# EasyEDA schematic 1-Schematic_Indoor meteo sensor.json
TITLE: Indoor environment monitor; REV: 1.0; Date: 2020-02-07; Sheet: 1/1; Drawn By: Tomáš Filo; Company: DIY
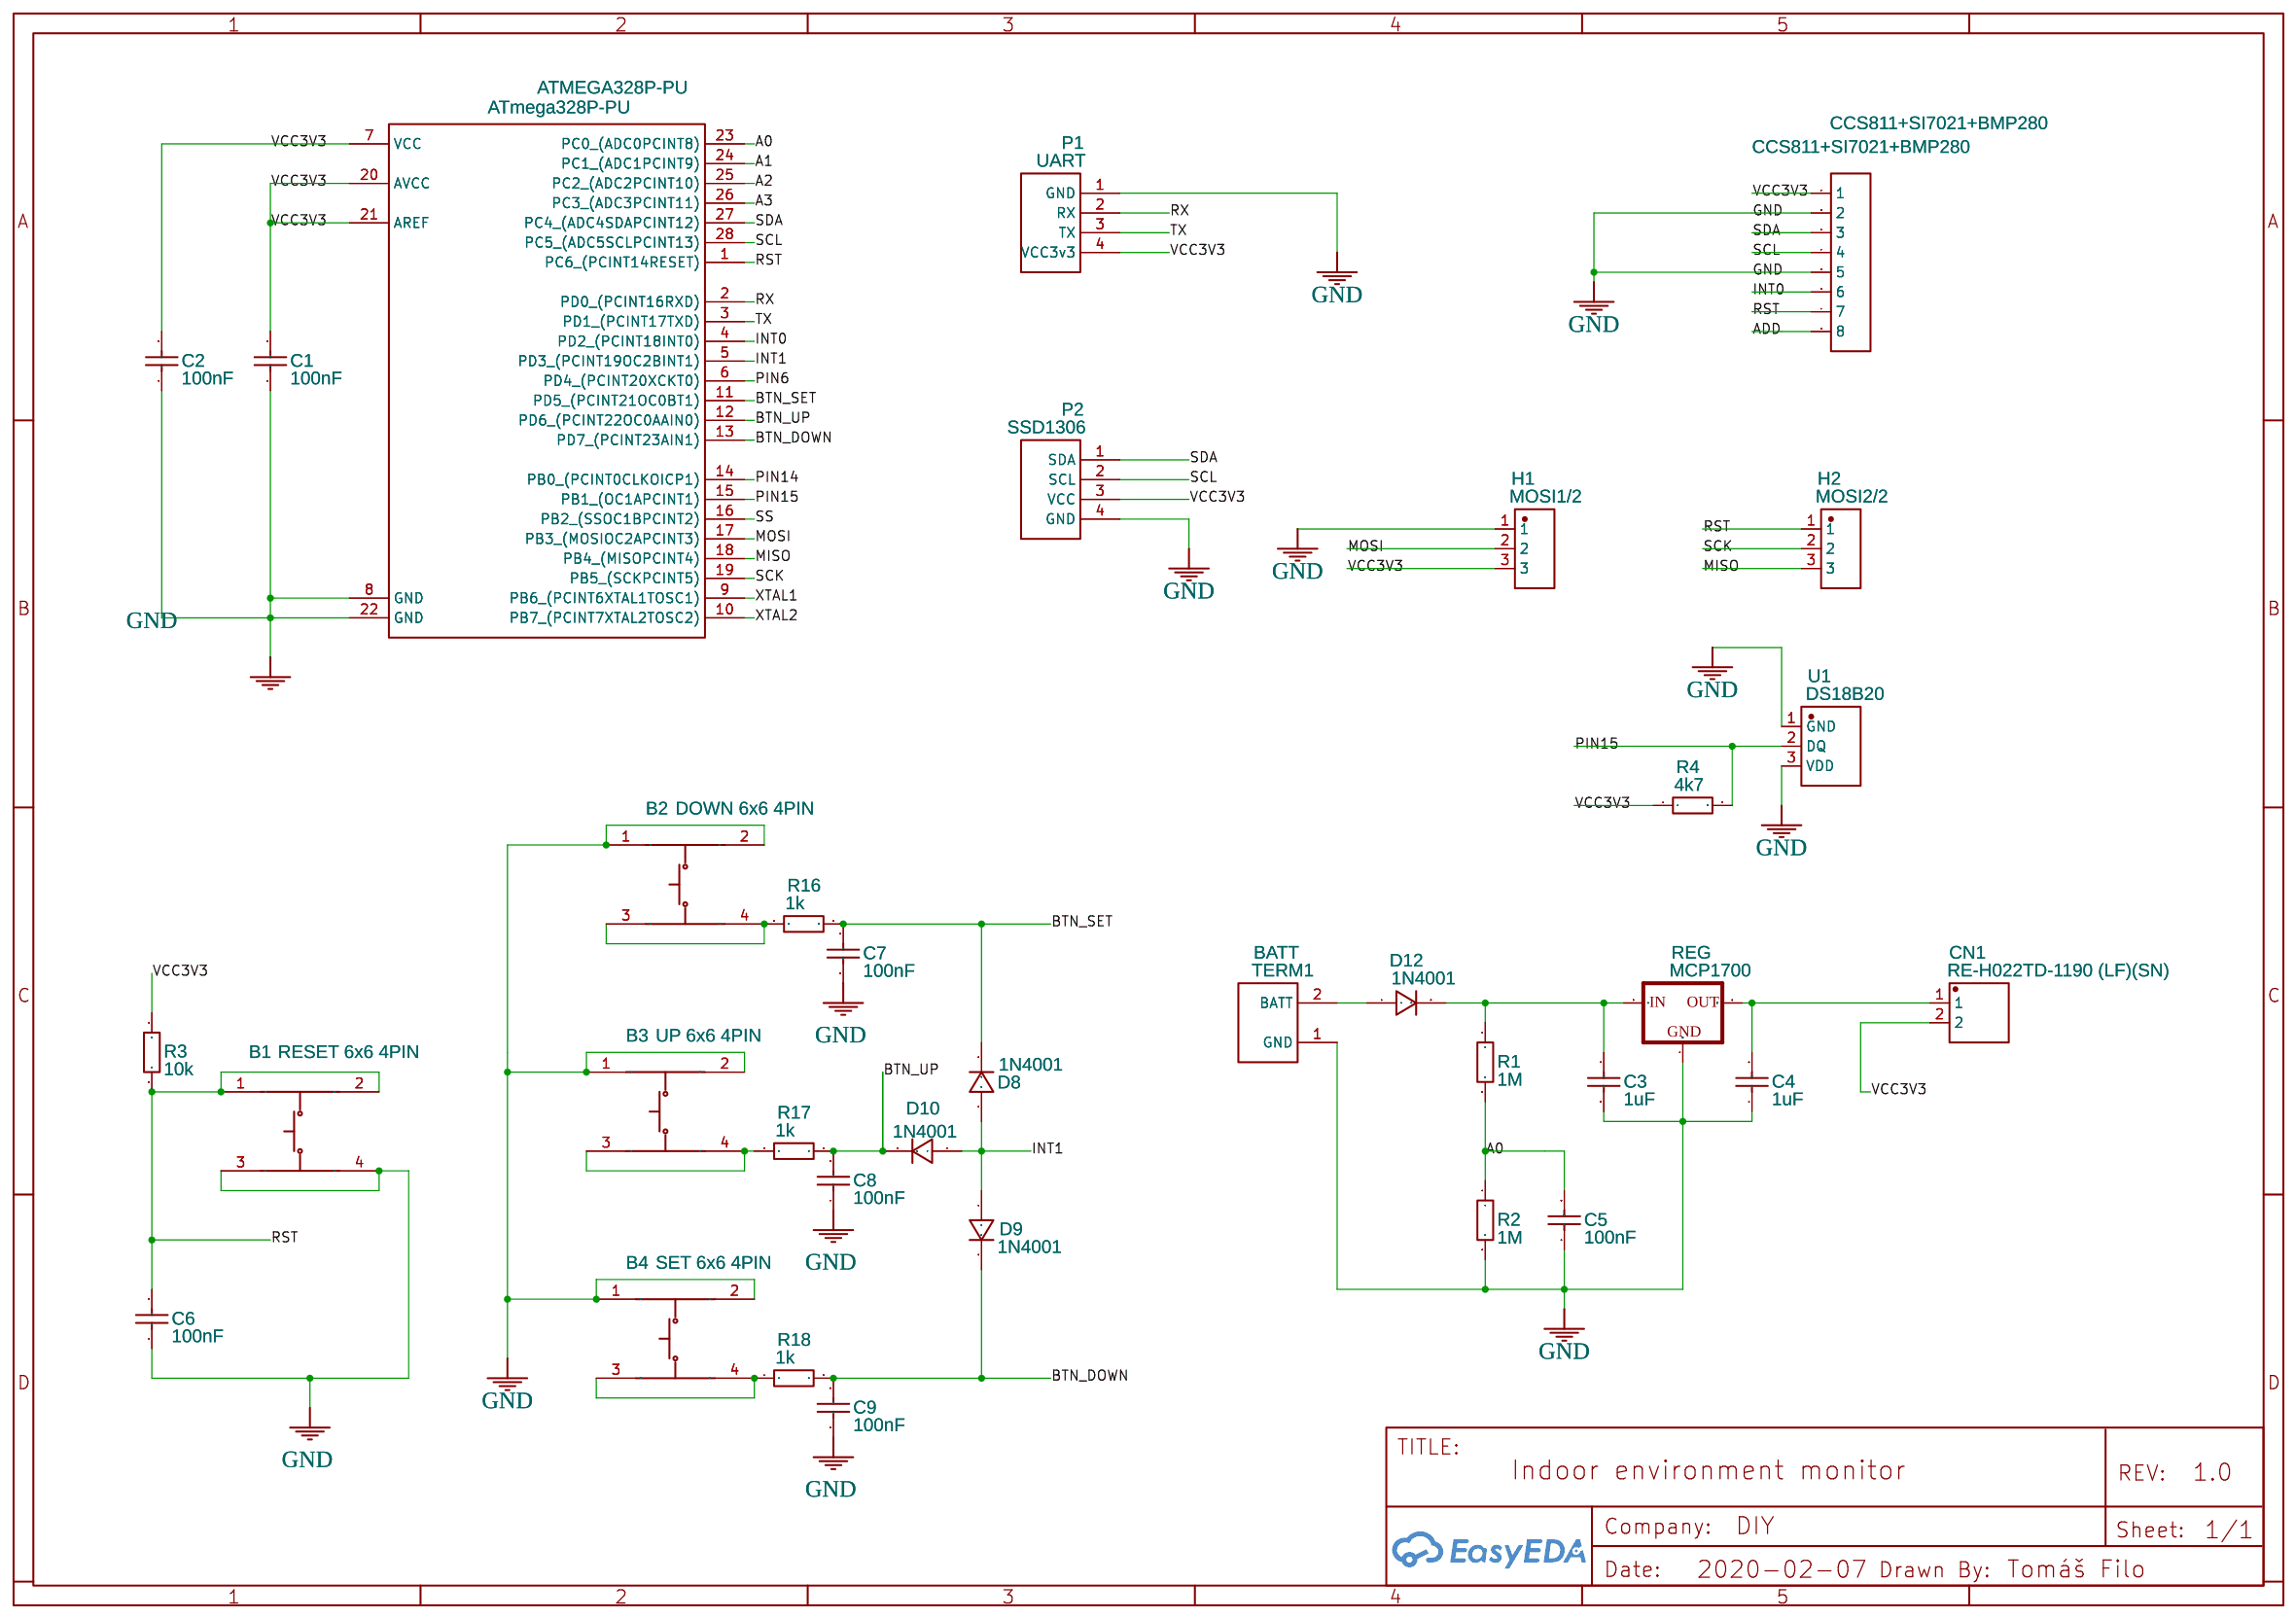
[diagram p0: schematic sheet]

## Parts
ATMEGA328P-PU  ATmega328P-PU  [DIP28]
B1  RESET 6x6 4PIN  [SW-TH_4PIN-L6.00-W6.00]
B2  DOWN 6x6 4PIN  [SW-TH_4PIN-L6.00-W6.00]
B3  UP 6x6 4PIN  [SW-TH_4PIN-L6.00-W6.00]
B4  SET 6x6 4PIN  [SW-TH_4PIN-L6.00-W6.00]
BATT  TERM1  [MKDSN1.5/2-5.08]
C1  100nF  [CAP-0.2]
C2  100nF  [CAP-0.2]
C3  1uF  [CAP-0.2]
C4  1uF  [CAP-0.2]
C5  100nF  [CAP-0.2]
C6  100nF  [CAP-0.2]
C7  100nF  [CAP-0.2]
C8  100nF  [CAP-0.2]
C9  100nF  [CAP-0.2]
CCS811+SI7021+BMP280  CCS811+SI7021+BMP280  [HDR-8X1/2.54]
CN1  RE-H022TD-1190 (LF)(SN)  [HDR-TH_2P-P2.54-V]
D8  1N4001  [DO-41]
D9  1N4001  [DO-41]
D10  1N4001  [DO-41]
D12  1N4001  [DO-41]
H1  MOSI1/2  [HDR-TH_3P-P2.54-V]
H2  MOSI2/2  [HDR-TH_3P-P2.54-V]
P1  UART  [DIP-1X4P2.54]
P2  SSD1306  [DIP-1X4P2.54]
R1  1M  [AXIAL-6.5X2.3(1/4W)]
R2  1M  [AXIAL-6.5X2.3(1/4W)]
R3  10k  [AXIAL-6.5X2.3(1/4W)]
R4  4k7  [AXIAL-6.5X2.3(1/4W)]
R16  1k  [AXIAL-6.5X2.3(1/4W)]
R17  1k  [AXIAL-6.5X2.3(1/4W)]
R18  1k  [AXIAL-6.5X2.3(1/4W)]
REG  MCP1700  [TO92-INLINE]
U1  DS18B20  [TO-92-3_L4.9-W3.7-P1.27-L]

## Library data of the parts
ATMEGA328P-PU = ATmega328P-PU: 8-bit AVR Microcontroller, 32KB Flash, 1KB EEPROM, 2KB SRAM, 28-pin PDIP, Industrial Grade (-40u7648 to 85u7648)
B1-B4 = -: Supplier: LCSC; Supplier Part: C381011; Manufacturer: XKB Enterprise; Manufacturer Part: TC-1102-C-E-B; Contributor: LCSC
BATT = -: Supplier: LCSC; Manufacturer: Phoenix Contact; Supplier Part: C91153
C1-C9 = CD1H224KC9BER1E000: Supplier: LCSC; Supplier Part: C263191; Manufacturer: Dersonic; Contributor: LCSC
CCS811+SI7021+BMP280 = -: Supplier: LCSC; Manufacturer: BOOMELE; Manufacturer Part: Female headerHDR1X8-2.54; Supplier Part: C27438
CN1 = RE-H022TD-1190 (LF)(SN): Supplier: LCSC; Supplier Part: C160332; Manufacturer: JST Sales America; Contributor: LCSC
D8-D10 D12 = -: Supplier Part: C169150; Supplier: LCSC; Manufacturer: DIOFIT; Contributor: LCSC
H1 H2 = 22025403P00CKMT: Supplier: LCSC; Manufacturer: Ckmtw; Contributor: LCSC; Supplier Part: C146690
P1 P2 = -: Supplier: LCSC; Manufacturer: Ckmtw; Manufacturer Part: 220S-1*4P H=8.5MM Ytype Gold-plated; Contributor: LCSC; Supplier Part: C124413
R1 R2 = MF1/4W-680Ω±1% T52: Supplier: LCSC; Supplier Part: C119320; Manufacturer: Chian Chia Elec; Contributor: LCSC
R3 R4 R16-R18 = MF1/4W-330Ω±1% T52: Supplier: LCSC; Supplier Part: C119313; Manufacturer: Chian Chia Elec; Contributor: LCSC
REG = -: Contributor: Adafruit
U1 = DS18B20: Supplier: LCSC; Supplier Part: C376006; Manufacturer: Youtai Semiconductor Co., Ltd.; Contributor: LCSC

## Nets
GND: ATMEGA328P-PU.8(GND) ATMEGA328P-PU.22(GND) B1.3 B1.4 B2.1 B2.2 B3.1 B3.2 B4.1 B4.2 BATT.1(GND) C1.1 C2.1 C3.1 C4.1 C5.1 C6.1 C7.1 C8.1 C9.1 CCS811+SI7021+BMP280.2 CCS811+SI7021+BMP280.5 H1.1 P1.1(GND) P2.4(GND) R2.2 REG.1(GND) U1.1(GND) U1.3(VDD)
VCC3V3: ATMEGA328P-PU.7(VCC) ATMEGA328P-PU.20(AVCC) ATMEGA328P-PU.21(AREF) C1.2 C2.2 CCS811+SI7021+BMP280.1 CN1.2 H1.3 P1.4(VCC3v3) P2.3(VCC) R3.1 R4.1
A0: ATMEGA328P-PU.23(PC0 (ADC0PCINT8)) C5.2 R1.2 R2.1
A1: ATMEGA328P-PU.24(PC1 (ADC1PCINT9))
A2: ATMEGA328P-PU.25(PC2 (ADC2PCINT10))
A3: ATMEGA328P-PU.26(PC3 (ADC3PCINT11))
ADD: CCS811+SI7021+BMP280.8
BTN_DOWN: ATMEGA328P-PU.13(PD7 (PCINT23AIN1)) C9.2 D9.2 R18.2
BTN_SET: ATMEGA328P-PU.11(PD5 (PCINT21OC0BT1)) C7.2 D8.2 R16.2
BTN_UP: ATMEGA328P-PU.12(PD6 (PCINT22OC0AAIN0)) C8.2 D10.2 R17.2
INT0: ATMEGA328P-PU.4(PD2 (PCINT18INT0)) CCS811+SI7021+BMP280.6
INT1: ATMEGA328P-PU.5(PD3 (PCINT19OC2BINT1)) D8.1 D9.1 D10.1
MISO: ATMEGA328P-PU.18(PB4 (MISOPCINT4)) H2.3
MOSI: ATMEGA328P-PU.17(PB3 (MOSIOC2APCINT3)) H1.2
PIN6: ATMEGA328P-PU.6(PD4 (PCINT20XCKT0))
PIN14: ATMEGA328P-PU.14(PB0 (PCINT0CLKOICP1))
PIN15: ATMEGA328P-PU.15(PB1 (OC1APCINT1)) R4.2 U1.2(DQ)
RST: ATMEGA328P-PU.1(PC6 (PCINT14RESET)) B1.1 B1.2 C6.2 CCS811+SI7021+BMP280.7 H2.1 R3.2
RX: ATMEGA328P-PU.2(PD0 (PCINT16RXD)) P1.2(RX)
SCK: ATMEGA328P-PU.19(PB5 (SCKPCINT5)) H2.2
SCL: ATMEGA328P-PU.28(PC5 (ADC5SCLPCINT13)) CCS811+SI7021+BMP280.4 P2.2(SCL)
SDA: ATMEGA328P-PU.27(PC4 (ADC4SDAPCINT12)) CCS811+SI7021+BMP280.3 P2.1(SDA)
SS: ATMEGA328P-PU.16(PB2 (SSOC1BPCINT2))
TX: ATMEGA328P-PU.3(PD1 (PCINT17TXD)) P1.3(TX)
XTAL1: ATMEGA328P-PU.9(PB6 (PCINT6XTAL1TOSC1))
XTAL2: ATMEGA328P-PU.10(PB7 (PCINT7XTAL2TOSC2))
Net-(B2-3): B2.3 B2.4 R16.1
Net-(B3-3): B3.3 B3.4 R17.1
Net-(B4-3): B4.3 B4.4 R18.1
Net-(BATT-2): BATT.2(BATT) D12.1
Net-(C3-2): C3.2 D12.2 R1.1 REG.2(IN)
Net-(C4-2): C4.2 CN1.1 REG.3(OUT)
